# Altium project CW3.PrjPcb
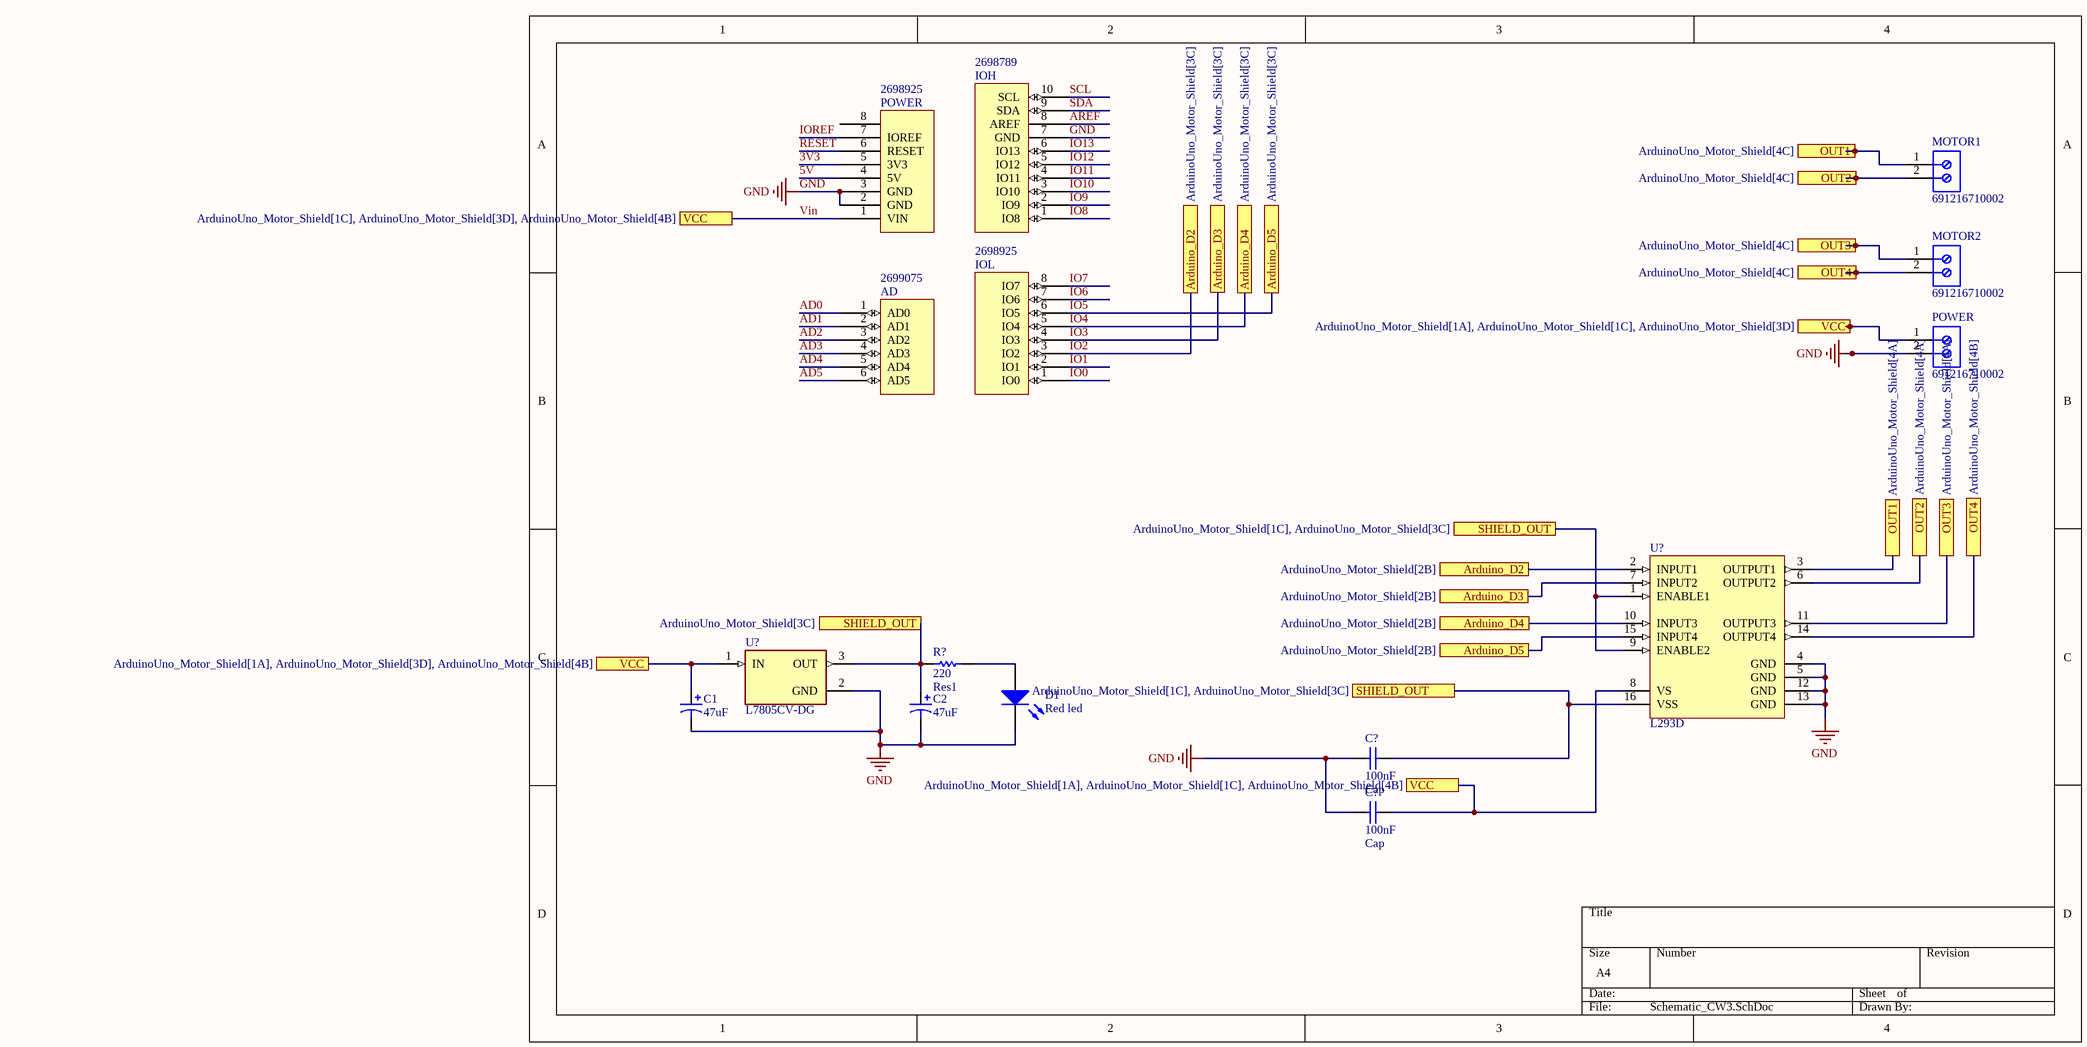
[diagram p0: Schematic_CW3.SchDoc]
1 sheet, 15 parts. Net scope: flat (ports and power ports of the same name join across sheets).
Board file: Layout_CW3.PcbDoc

## Sheet Schematic_CW3.SchDoc
size A4; SheetNumber: 1; SheetTotal: 1; SPICEModelCacheOSELQMXG: <root> / <DocumentId>OSELQMXG</DocumentId> / <CacheFrame Number="0"> / <Model Name="led0" Kind="MDL"> / <Text>*Typ INFRARED GaAs LED: Vf=1.2V Vr=5V If=40mA trr=3uS / *LED Pinout: 1=A, 2=K / .MODEL LED0 D (IS=93.5P RS=84M N=2.63 BV=5 IBV=10U / + CJO=2.97P VJ=.75 M=.333 TT=4.32U)</Text> / </Model> / </CacheFrame> / </root>

### Parts
(Parts that share a designator on the sheet are numbered #1, #2 ... from top to bottom, then left to right.)
AD  Supplier Part Number 4: 2699075  [Header 6x1 8.5mm]  (hidden comment: AD)
C1  value 47uF  [RB7.6-15]
C2  value 47uF  [RB7.6-15]
C?#1  Cap  value 100nF  [RAD-0.3]
C?#2  Cap  value 100nF  [RAD-0.3]
D1  Red led  [LED-0]
IOH  Supplier Part Number 3: 2698789  [Header 10x1 8.5mm]  (hidden comment: IOH)
IOL  Supplier Part Number 4: 2698925  [Header 8x1 8.5mm]  (hidden comment: IOL)
MOTOR1  691216710002  [691216710002]
MOTOR2  691216710002  [691216710002]
POWER#1  Supplier Part Number 4: 2698925  [Header 8x1 8.5mm]  (hidden comment: POWER_UNO)
POWER#2  691216710002  [691216710002]
R?  Res1  value 220  [AXIAL-0.3]
U?#1  L293D  [STM-L293D-16]
U?#2  L7805CV-DG  [TO255P1040X460X2890-3]

### Ports
Arduino_D2 (see ArduinoUno_Motor_Shield[2B]), Arduino_D2 (see ArduinoUno_Motor_Shield[3C]), Arduino_D3 (see ArduinoUno_Motor_Shield[2B]), Arduino_D3 (see ArduinoUno_Motor_Shield[3C]), Arduino_D4 (see ArduinoUno_Motor_Shield[2B]), Arduino_D4 (see ArduinoUno_Motor_Shield[3C]), Arduino_D5 (see ArduinoUno_Motor_Shield[2B]), Arduino_D5 (see ArduinoUno_Motor_Shield[3C]), OUT1 (see ArduinoUno_Motor_Shield[4A]), OUT1 (see ArduinoUno_Motor_Shield[4C]), OUT2 (see ArduinoUno_Motor_Shield[4A]), OUT2 (see ArduinoUno_Motor_Shield[4C]), OUT3 (see ArduinoUno_Motor_Shield[4A]), OUT3 (see ArduinoUno_Motor_Shield[4C]), OUT4 (see ArduinoUno_Motor_Shield[4B]), OUT4 (see ArduinoUno_Motor_Shield[4C]), SHIELD_OUT (see ArduinoUno_Motor_Shield[1C], ArduinoUno_Motor_Shield[3C]), SHIELD_OUT (see ArduinoUno_Motor_Shield[3C]), VCC (see ArduinoUno_Motor_Shield[1A], ArduinoUno_Motor_Shield[1C], ArduinoUno_Motor_Shield[3D]), VCC (see ArduinoUno_Motor_Shield[1A], ArduinoUno_Motor_Shield[1C], ArduinoUno_Motor_Shield[4B]), VCC (see ArduinoUno_Motor_Shield[1A], ArduinoUno_Motor_Shield[3D], ArduinoUno_Motor_Shield[4B]), VCC (see ArduinoUno_Motor_Shield[1C], ArduinoUno_Motor_Shield[3D], ArduinoUno_Motor_Shield[4B])

### Nets
GND: C1.2 C2.2 C?#1.2 C?#2.2 D1.2(K) IOH.7(GND) POWER#1.2(GND) POWER#1.3(GND) POWER#2.2 U?#1.4(GND) U?#1.5(GND) U?#1.12(GND) U?#1.13(GND) U?#2.2(GND)
3V3: POWER#1.5(3V3)
5V: POWER#1.4(5V)
AD0: AD.1(AD0)
AD1: AD.2(AD1)
AD2: AD.3(AD2)
AD3: AD.4(AD3)
AD4: AD.5(AD4)
AD5: AD.6(AD5)
AREF: IOH.8(AREF)
IO0: IOL.1(IO0)
IO1: IOL.2(IO1)
IO2: IOL.3(IO2) U?#1.2(INPUT1) ; port Arduino_D2
IO3: IOL.4(IO3) U?#1.7(INPUT2) ; port Arduino_D3
IO4: IOL.5(IO4) U?#1.10(INPUT3) ; port Arduino_D4
IO5: IOL.6(IO5) U?#1.15(INPUT4) ; port Arduino_D5
IO6: IOL.7(IO6)
IO7: IOL.8(IO7)
IO8: IOH.1(IO8)
IO9: IOH.2(IO9)
IO10: IOH.3(IO10)
IO11: IOH.4(IO11)
IO12: IOH.5(IO12)
IO13: IOH.6(IO13)
IOREF: POWER#1.7(IOREF)
RESET: POWER#1.6(RESET)
SCL: IOH.10(SCL)
SDA: IOH.9(SDA)
Vin: C1.1 C?#2.1 POWER#1.1(VIN) POWER#2.1 U?#1.8(VS) U?#2.1(IN) ; port VCC
NetC2_1: C2.1 C?#1.1 R?.1 U?#1.1(ENABLE1) U?#1.9(ENABLE2) U?#1.16(VSS) U?#2.3(OUT) ; port SHIELD_OUT
NetD1_1: D1.1(A) R?.2
NetMOTOR1_1: MOTOR1.1 U?#1.3(OUTPUT1) ; port OUT1
NetMOTOR1_2: MOTOR1.2 U?#1.6(OUTPUT2) ; port OUT2
NetMOTOR2_1: MOTOR2.1 U?#1.11(OUTPUT3) ; port OUT3
NetMOTOR2_2: MOTOR2.2 U?#1.14(OUTPUT4) ; port OUT4

Not connected (* = marked no-connect by the designer): POWER#1 8

### Library data of the parts
C1 C2 = Cap Pol1: Polarized Capacitor (Radial); Published: 8-Jun-2000; LatestRevisionDate: 17-Jul-2002; LatestRevisionNote: Re-released for DXP Platform.; PackageReference: RB7.6-15; Publisher: Altium Limited; PackageDescription: Polarized Capacitor (Radial); 2 Leads
C?#1 C?#2 = Cap: Capacitor; Published: 8-Jun-2000; LatestRevisionDate: 17-Jul-2002; LatestRevisionNote: Re-released for DXP Platform.; PackageReference: RAD-0.3; Publisher: Altium Limited; PackageDescription: Radial Cap, Thru-Hole; 2 Leads; 0.3 in Pin Spacing
D1 = LED0: Typical INFRARED GaAs LED; Published: 8-Jun-2000; LatestRevisionDate: 08-Jul-2005; LatestRevisionNote: Mech Layer 1 removed.; PackageReference: LED-0; Publisher: Altium Limited; PackageDescription: LED; 2 Leads
MOTOR1 MOTOR2 POWER#2 = CMP-1502-02532-2: NexarPartId: 94172716; Voltage Rating: 300V; Number of Contacts: 2; Current Rating: 14A; Height: 13.9mm; Min Operating Temperature: -30°C; Lead Pitch: 5mm; Number of Pins: 2; Contact Material: Nickel, Tin; RoHS: Non-Compliant; Max Operating Temperature: 120°C; Number of Rows: 1; Packaging: Box
R? = Res1: Resistor; Published: 8-Jun-2000; LatestRevisionDate: 17-Jul-2002; LatestRevisionNote: Re-released for DXP Platform.; PackageReference: AXIAL-0.3; Publisher: Altium Limited; PackageDescription: Axial Device, Thru-Hole; 2 Leads; 0.3 in Pin Spacing
U?#1 = CMP-2000-06524-1: Push-Pull Four Channel Driver with Diode, 4.5 to 36 V, -40 to 150 degC, 16-Pin PDIP, RoHS, Tube; Manufacturer: STMicroelectronics; Number of Outputs: 4; Current - Peak Output: 1.2A; Current - Output / Channel: 600mA; Input Type: Non-Inverting; Other Related Documents: L293DViewAllSpecifications; Dynamic Catalog: HalfBridge; Voltage - Supply: 4.5V~36V; Other Names: 497-2936-5; Package / Case: 16-DIP(0.300",7.62mm); PartNumber: L293D; Operating Temperature: -40°C~150°C; Datasheet URL: http://www.st.com/st-web-ui/static/active/en/resource/technical/document/datasheet/CD00000059.pdf; Supplier Device Package: 16-PowerDIP; Packaging: Tube; Package Description: 16-Pin Thru-Hole Dual-In-Line, Body 20 x 6.85 mm, Pitch 2.54 mm; Standard Package: 25; Datasheet Version: 07/2003; On-State Resistance: -; Manufacturer URL: http://www.st.com/; Category: IntegratedCircuits(ICs); Family: PMIC-MOSFET,BridgeDrivers-InternalSwitch; Type: HalfBridge; Series: -; Mounting Technology: ThroughHole; Package Reference: DIP-16; Mounting Type: ThroughHole
U?#2 = L7805CV-DG: Linear Voltage Regulator IC Positive Fixed 1 Output 1.5A TO-220; MF: STMicroelectronics; SnapEDA_Link: https://www.snapeda.com/parts/L7805CV-DG/STMicroelectronics/view-part/?ref=snap; Package: TO-220 STMicroelectronics; Value: *; MP: L7805CV-DG; Check_prices: https://www.snapeda.com/parts/L7805CV-DG/STMicroelectronics/view-part/?ref=eda
AD = AD: Supplier 1: Arrow; Supplier Part Number 1: 2699089; Supplier 2: Digi-Key; Supplier Part Number 2: SAM1198-06-ND; Supplier 3: Arrow; Supplier Part Number 3: 2699088; Supplier 4: Arrow
IOH = IOH: Supplier 1: Arrow; Supplier Part Number 1: 2698803S4475693N1004; Supplier 2: Digi-Key; Supplier Part Number 2: SAM1198-10-ND; Supplier 3: Arrow
IOL = IOL: Supplier 1: Digi-Key; Supplier Part Number 1: SAM1198-08-ND; Supplier 2: Arrow; Supplier Part Number 2: 2698939; Supplier 3: Arrow; Supplier Part Number 3: 2698940; Supplier 4: Arrow
POWER#1 = POWER_UNO: Supplier 1: Digi-Key; Supplier Part Number 1: SAM1198-08-ND; Supplier 2: Arrow; Supplier Part Number 2: 2698939; Supplier 3: Arrow; Supplier Part Number 3: 2698940; Supplier 4: Arrow